# EAGLE schematic untitled (EAGLE 6.3)
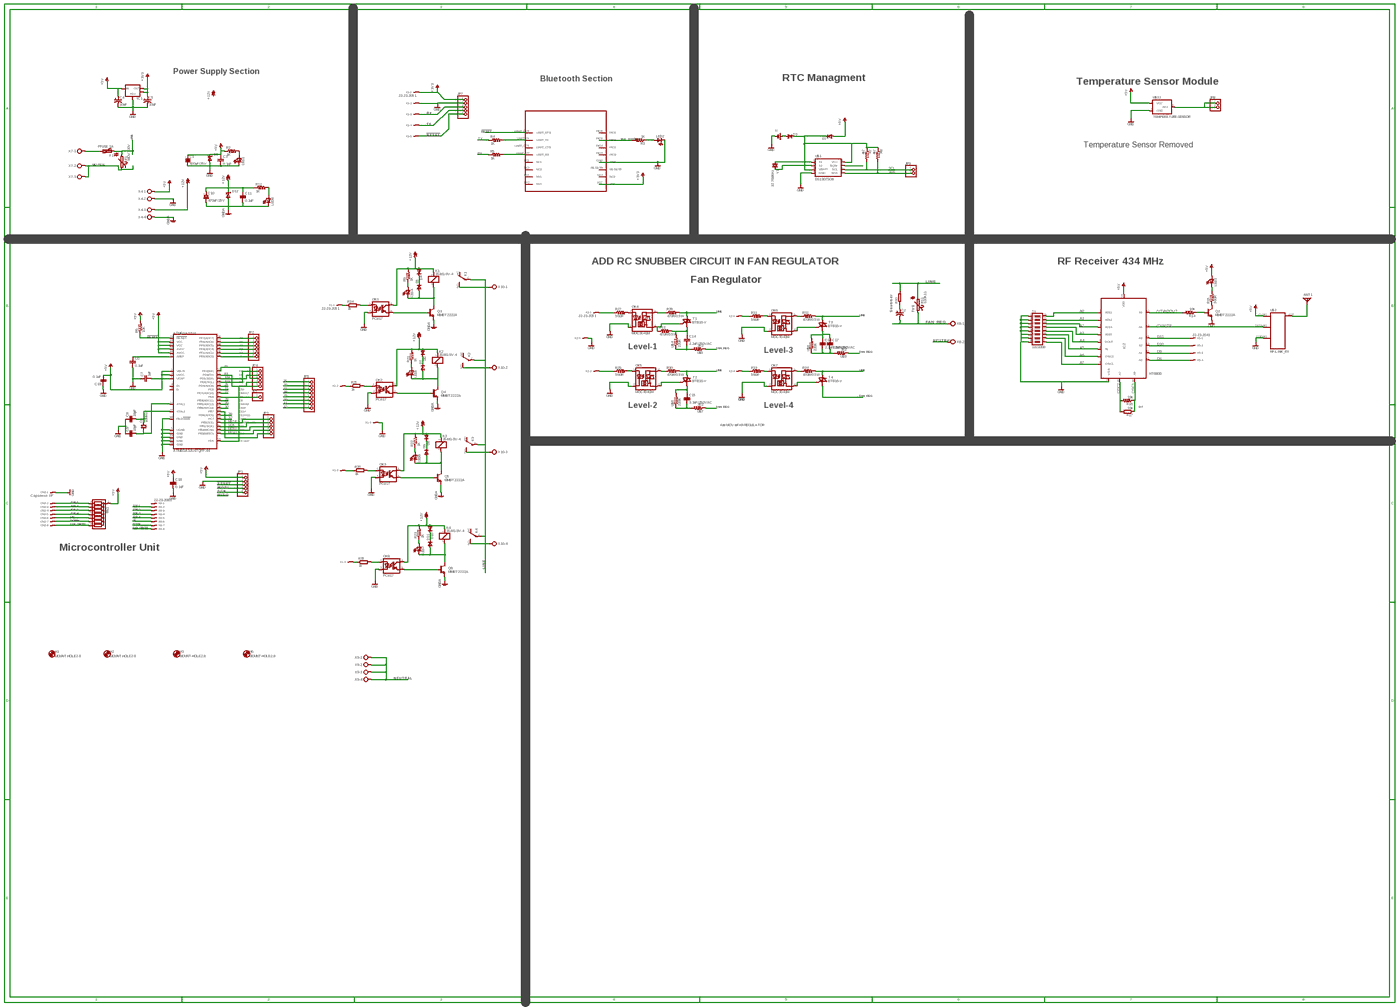
[diagram p0: schematic, sheet 1, overview]
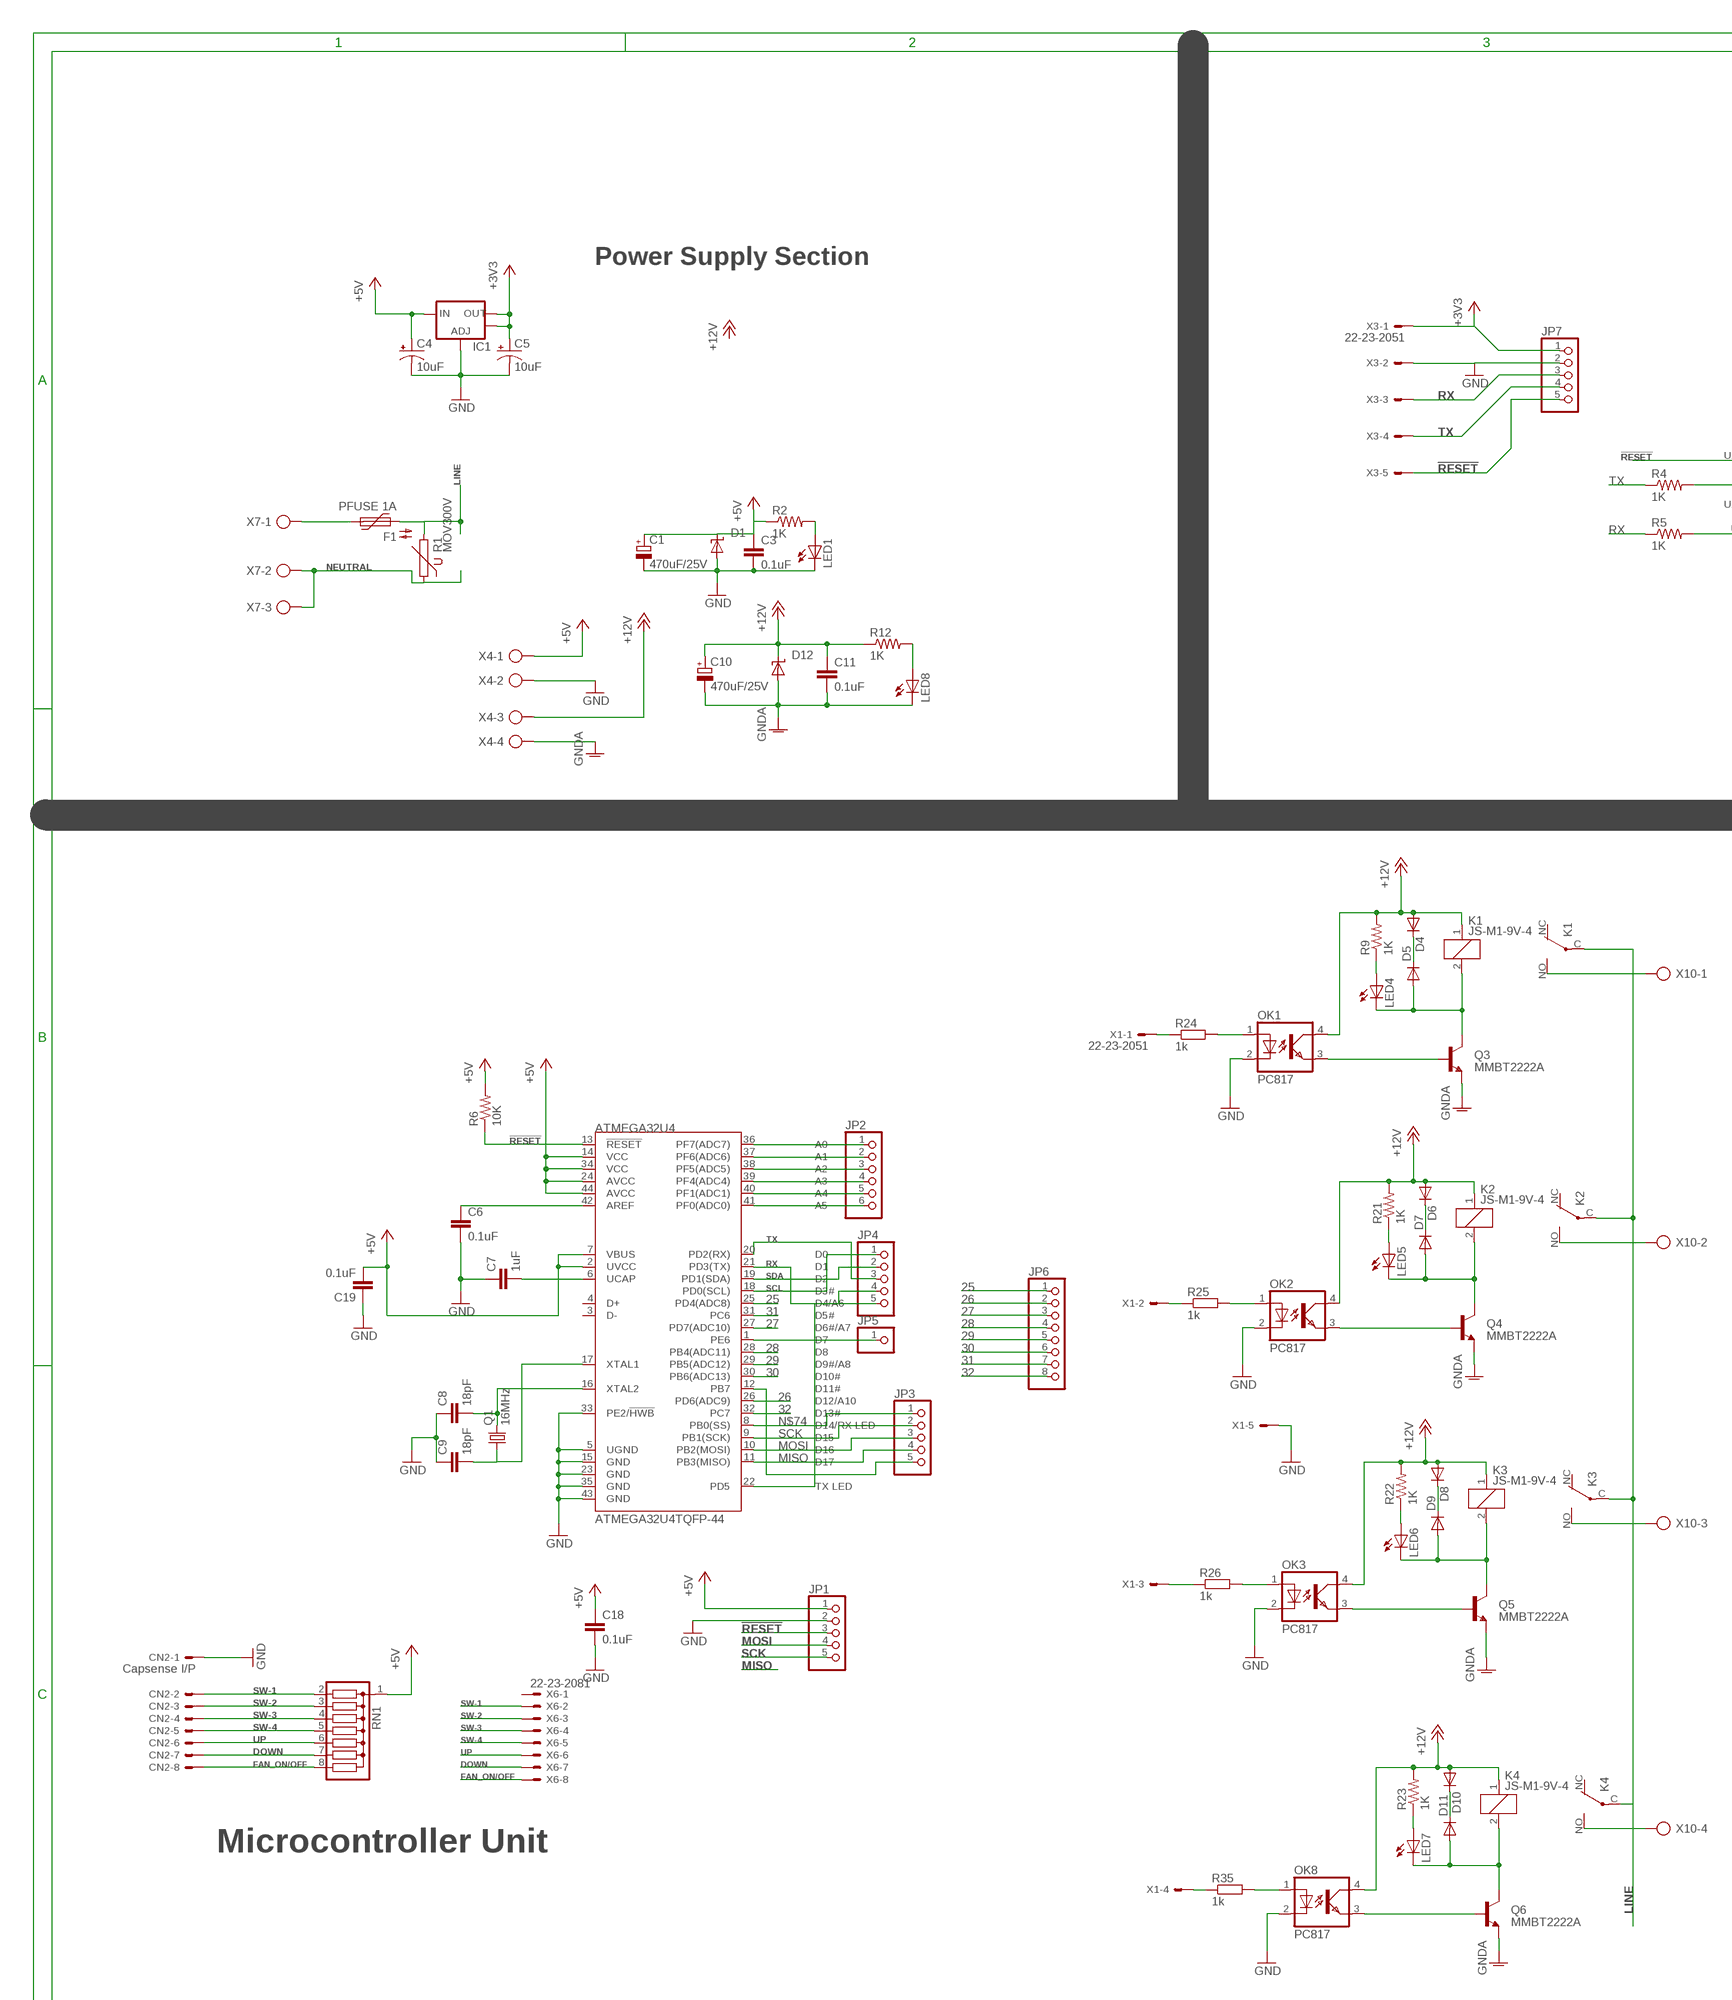
[diagram p1: schematic, sheet 1, part 1 of 6]
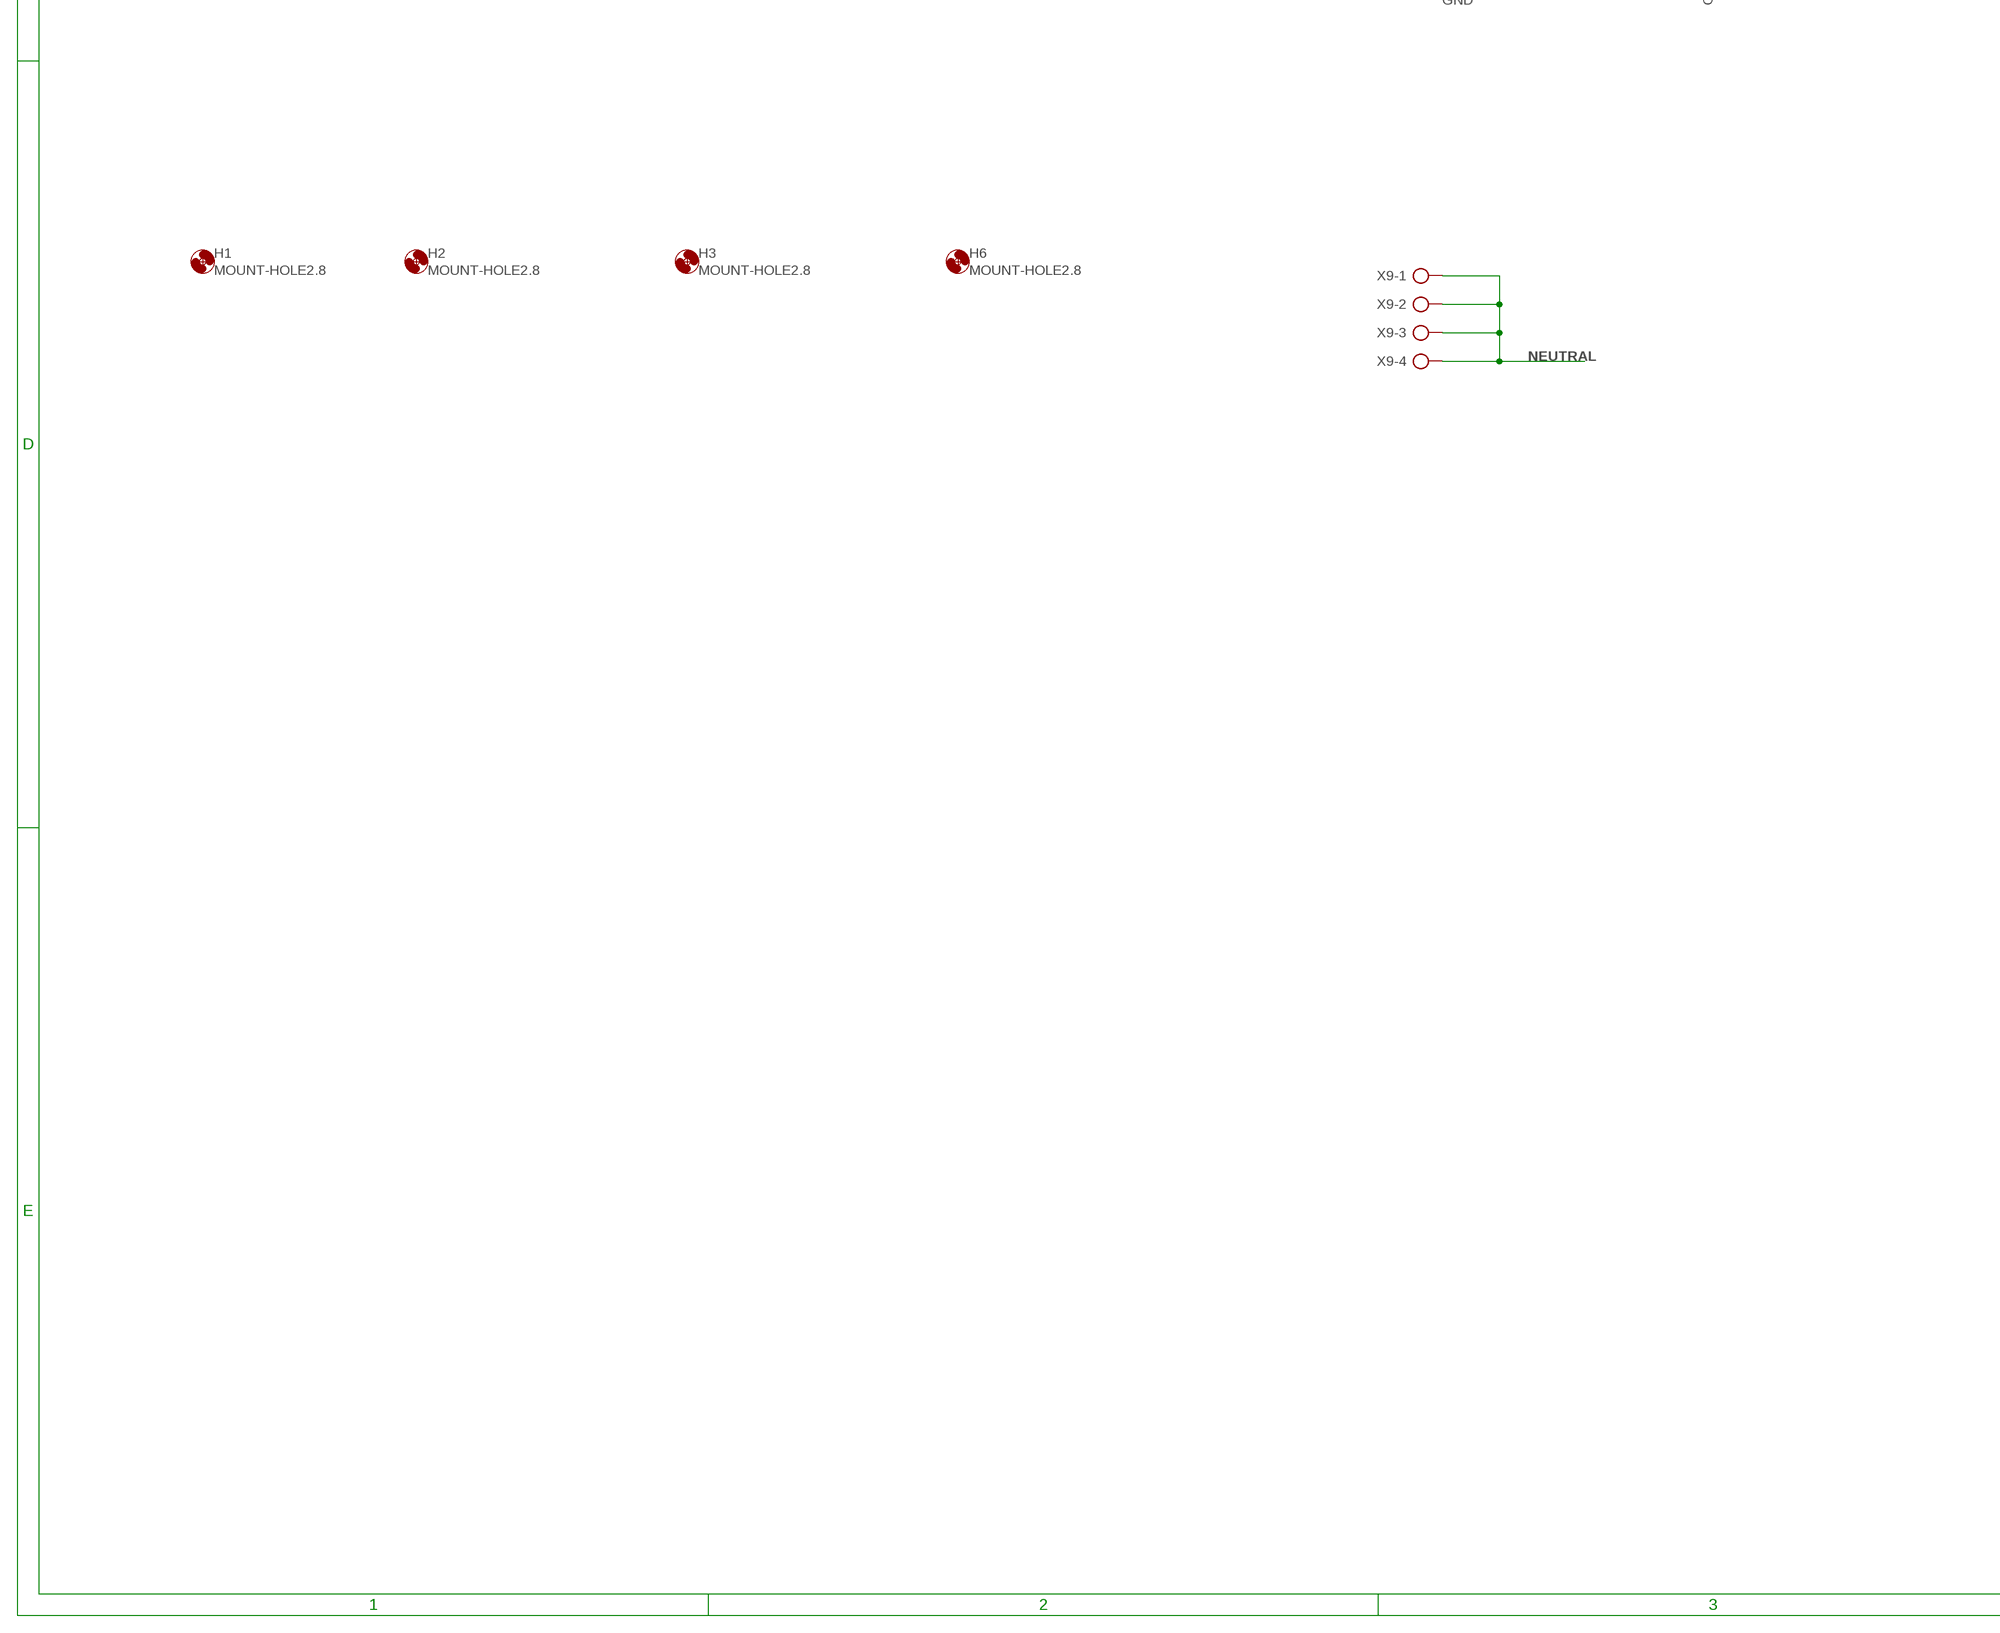
[diagram p2: schematic, sheet 1, part 2 of 6]
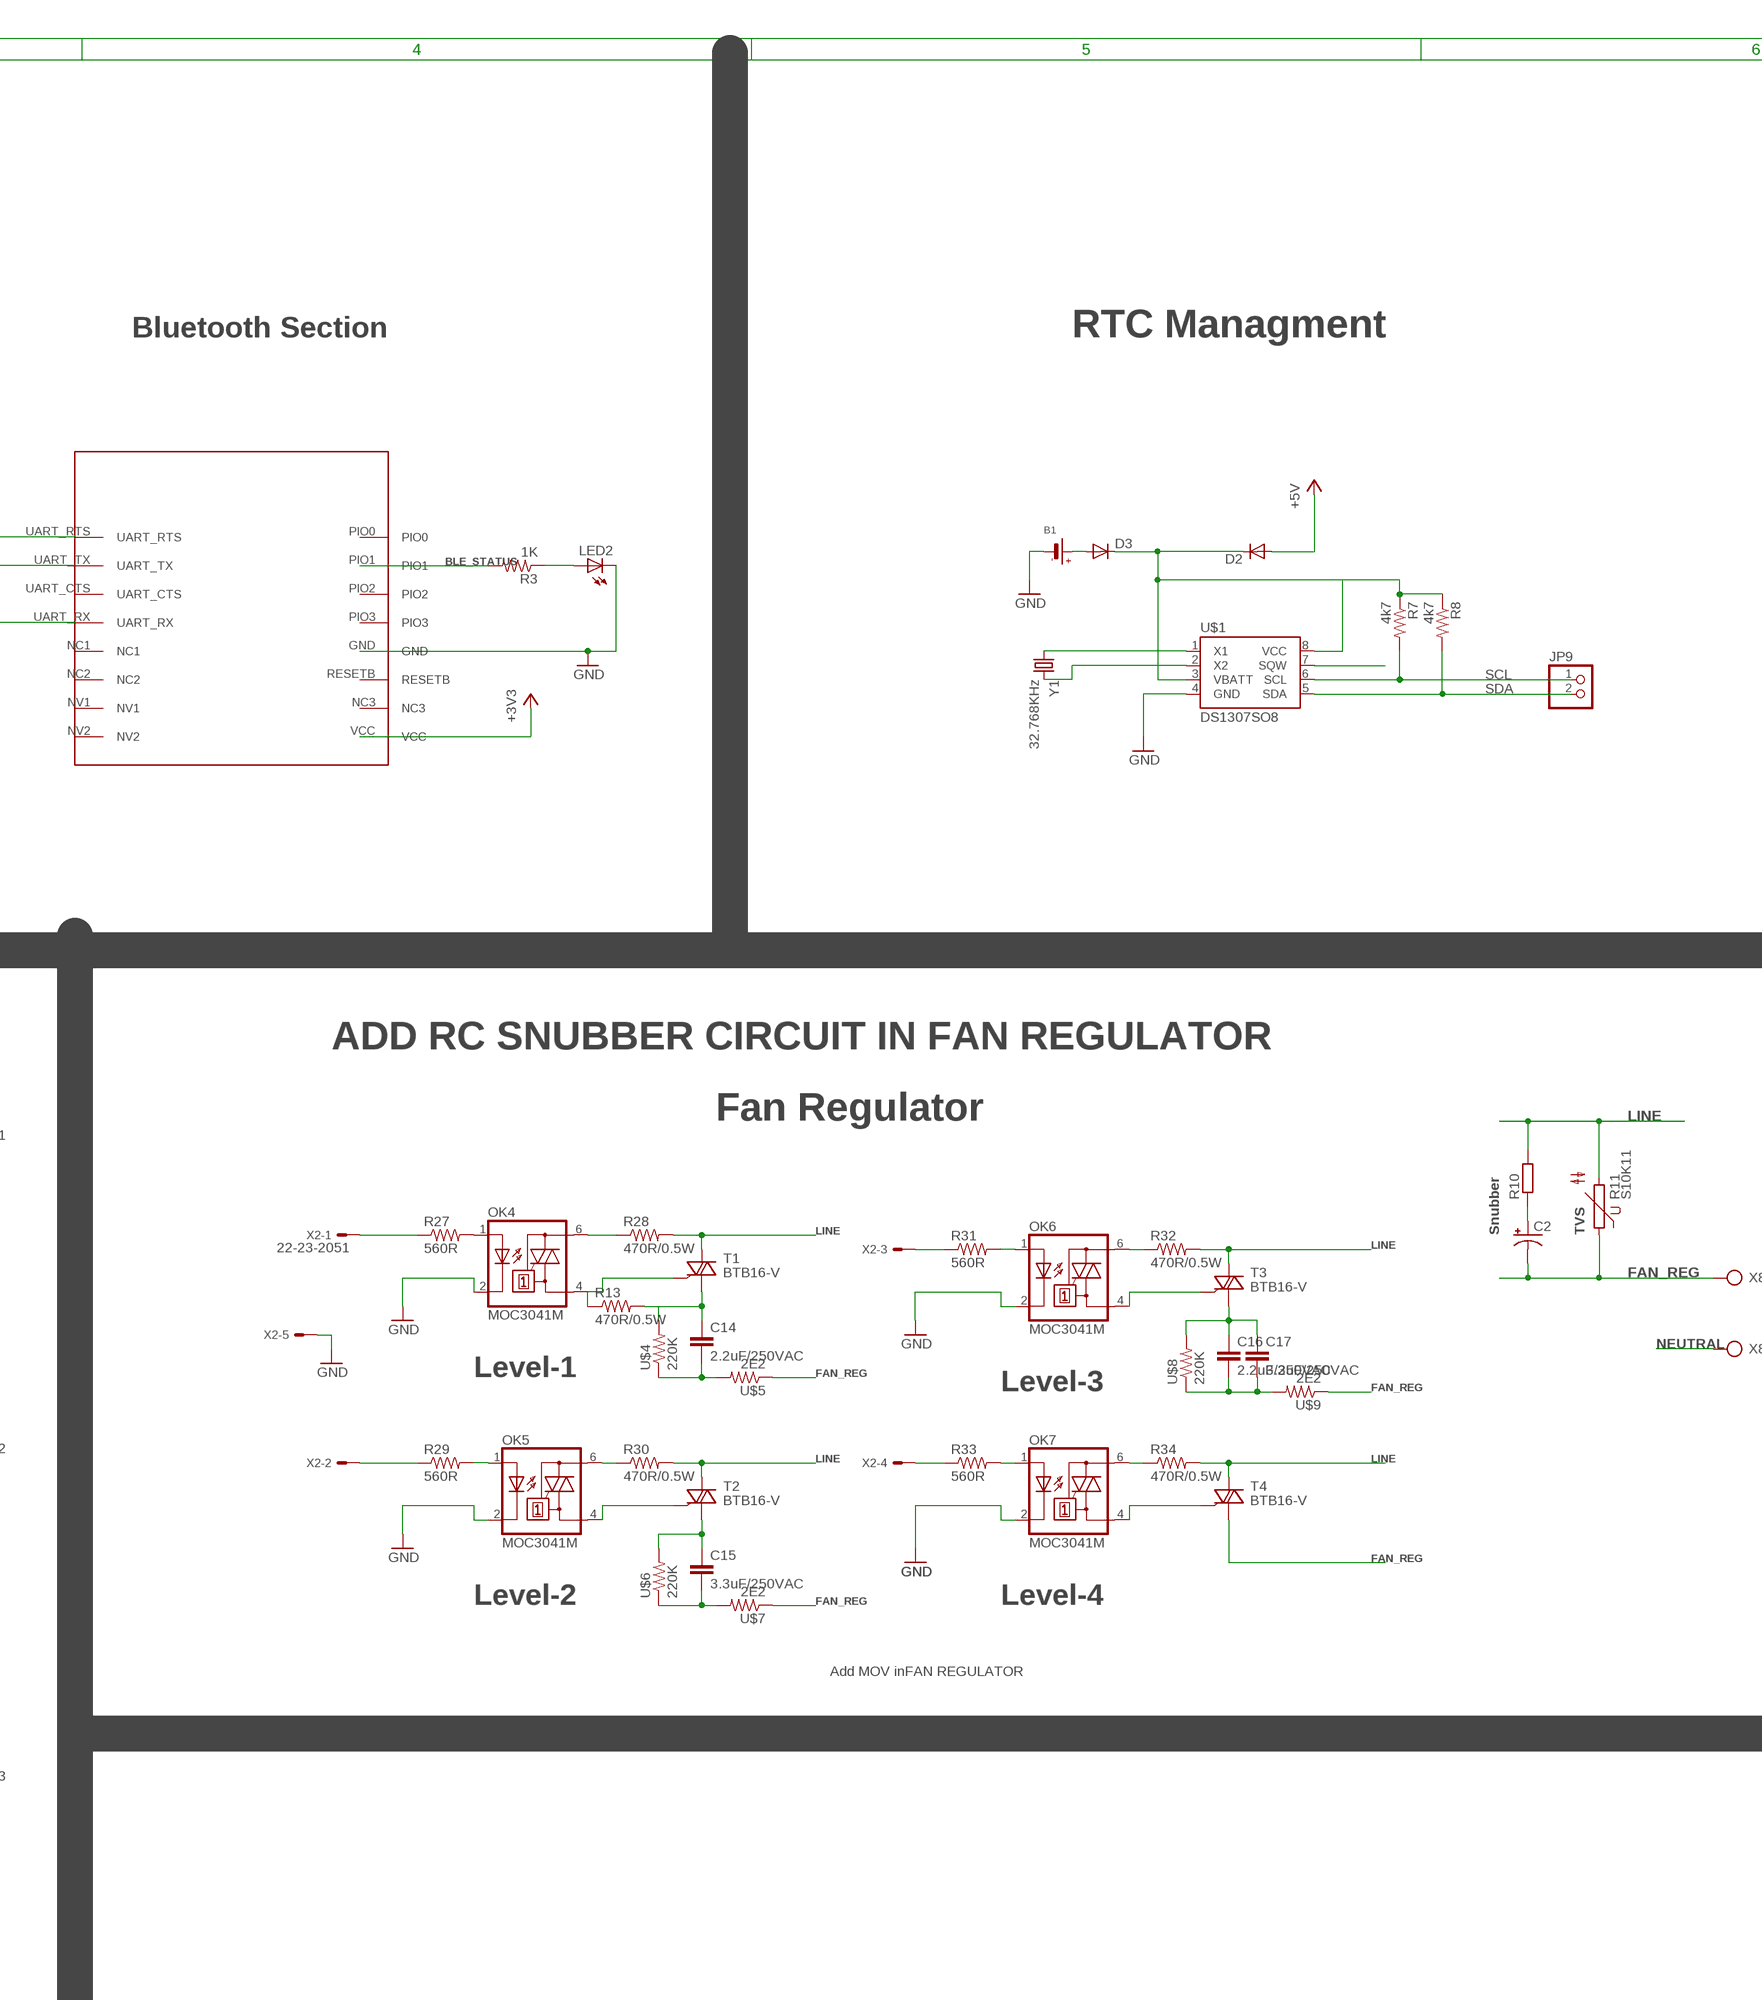
[diagram p3: schematic, sheet 1, part 3 of 6]
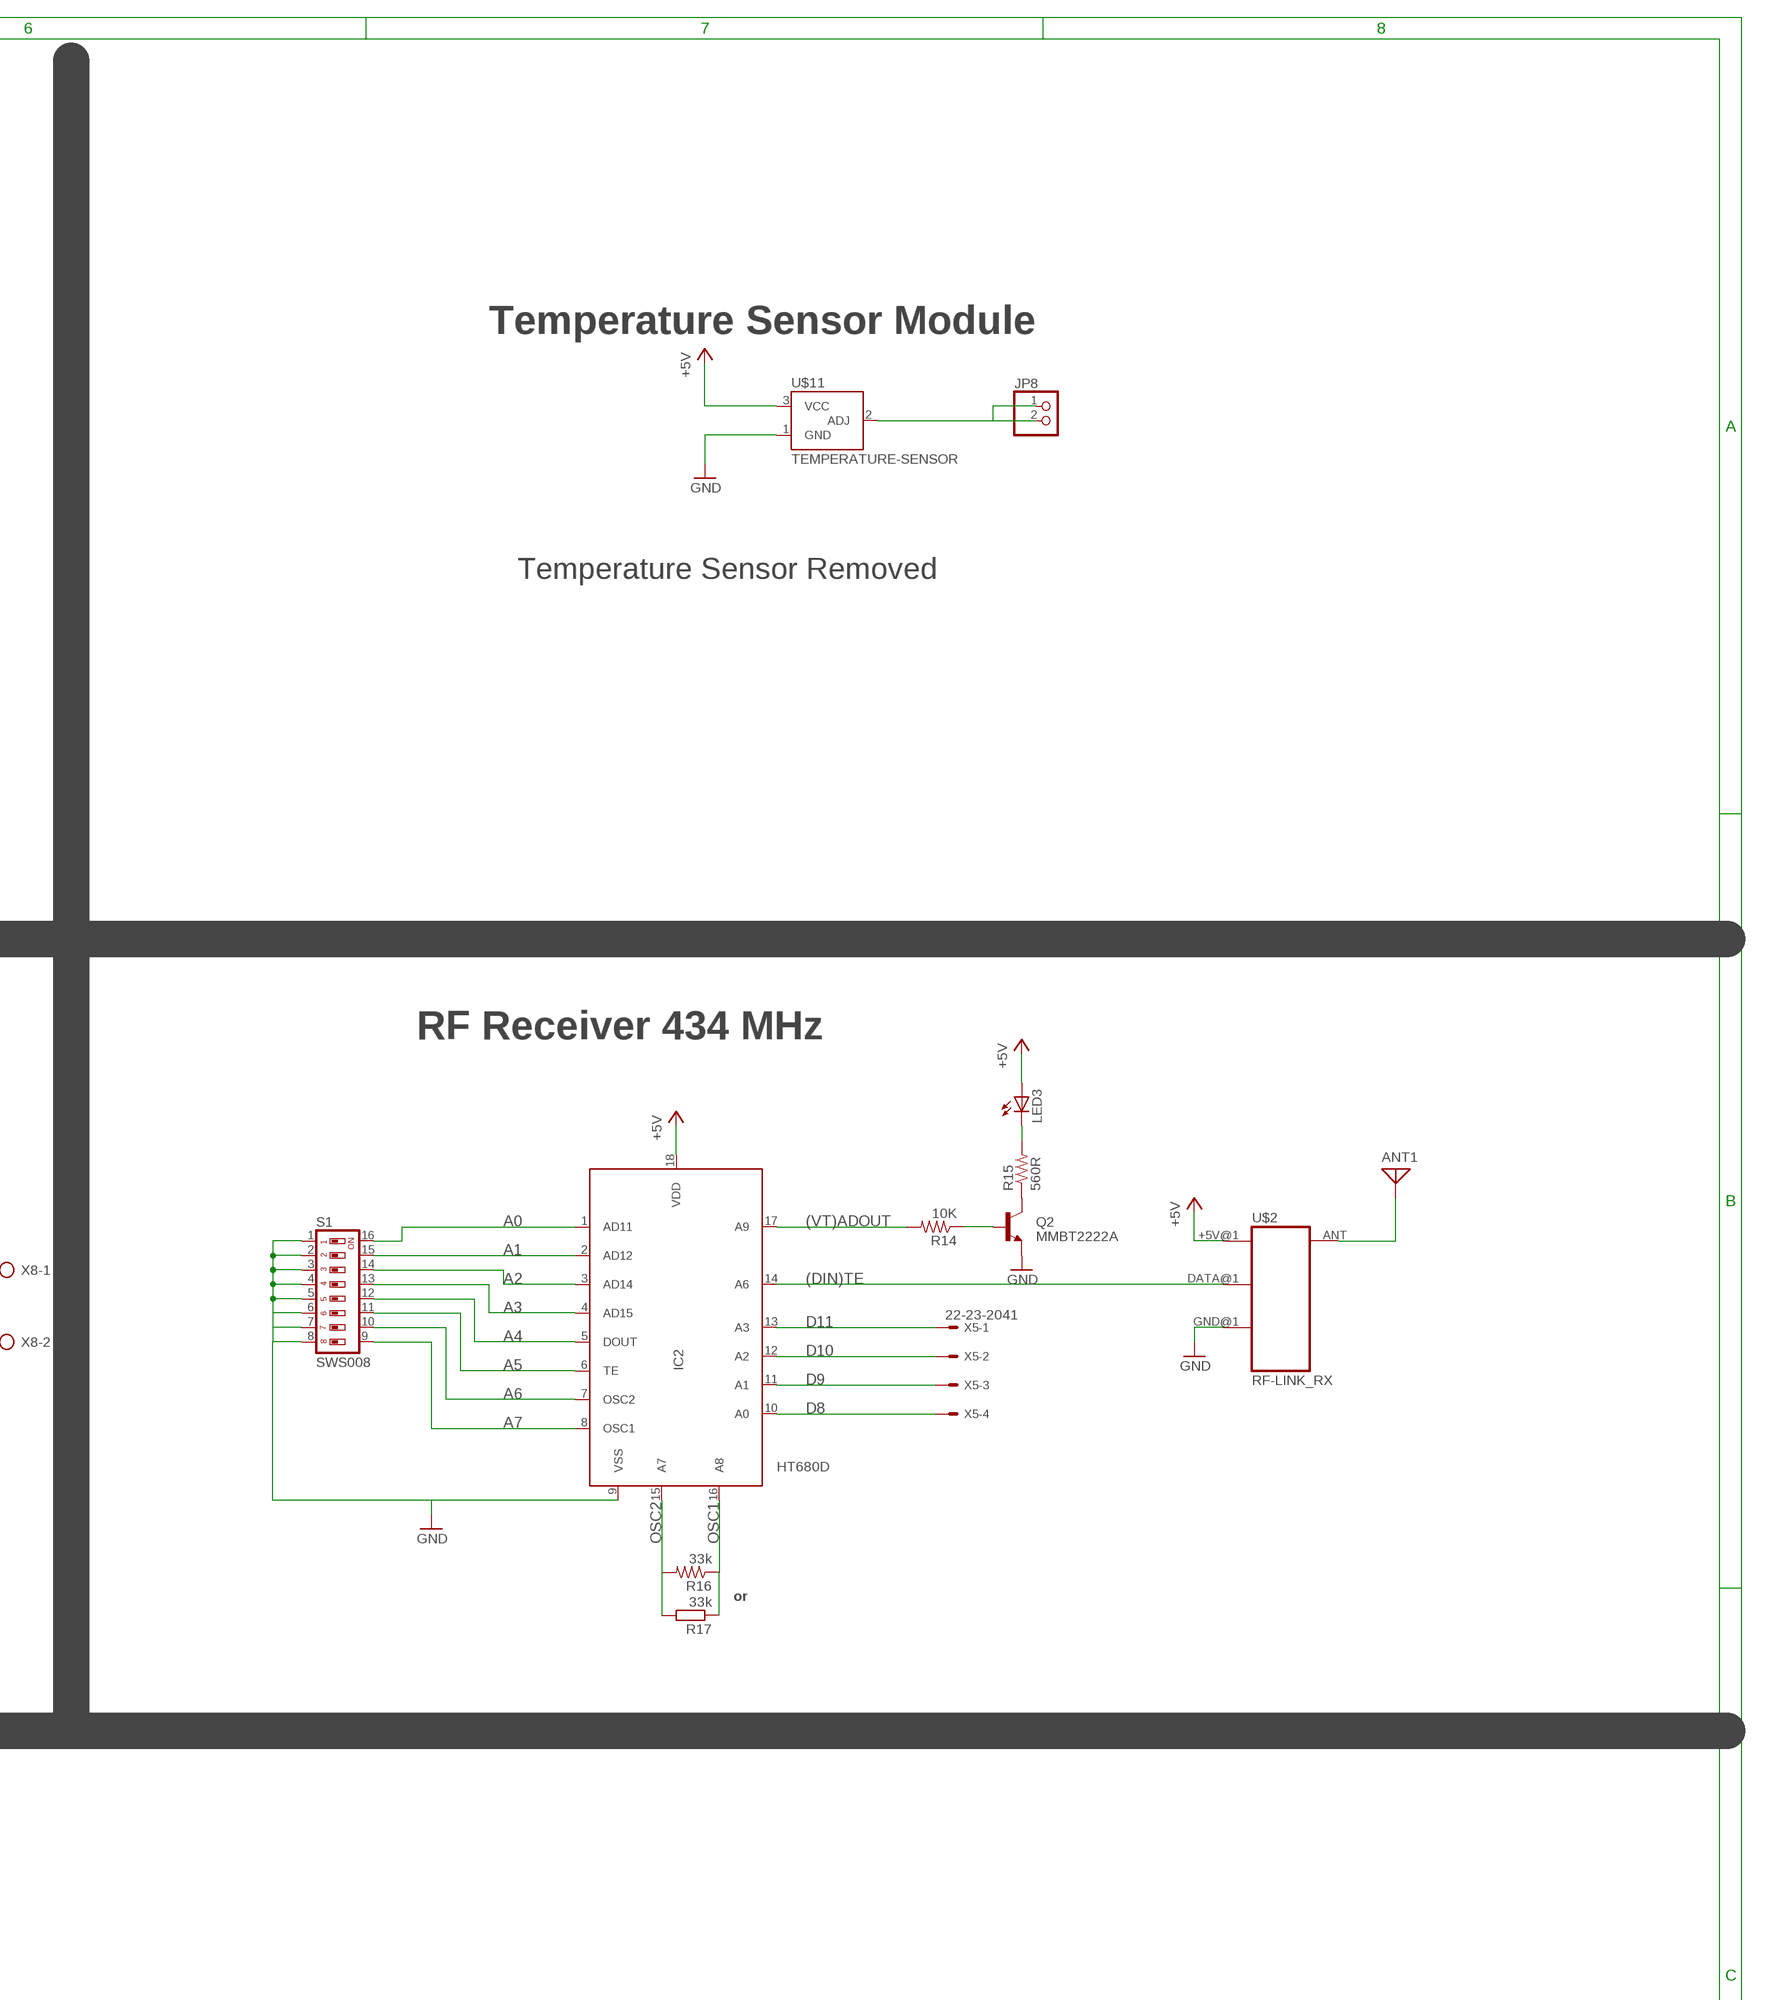
[diagram p4: schematic, sheet 1, part 4 of 6]
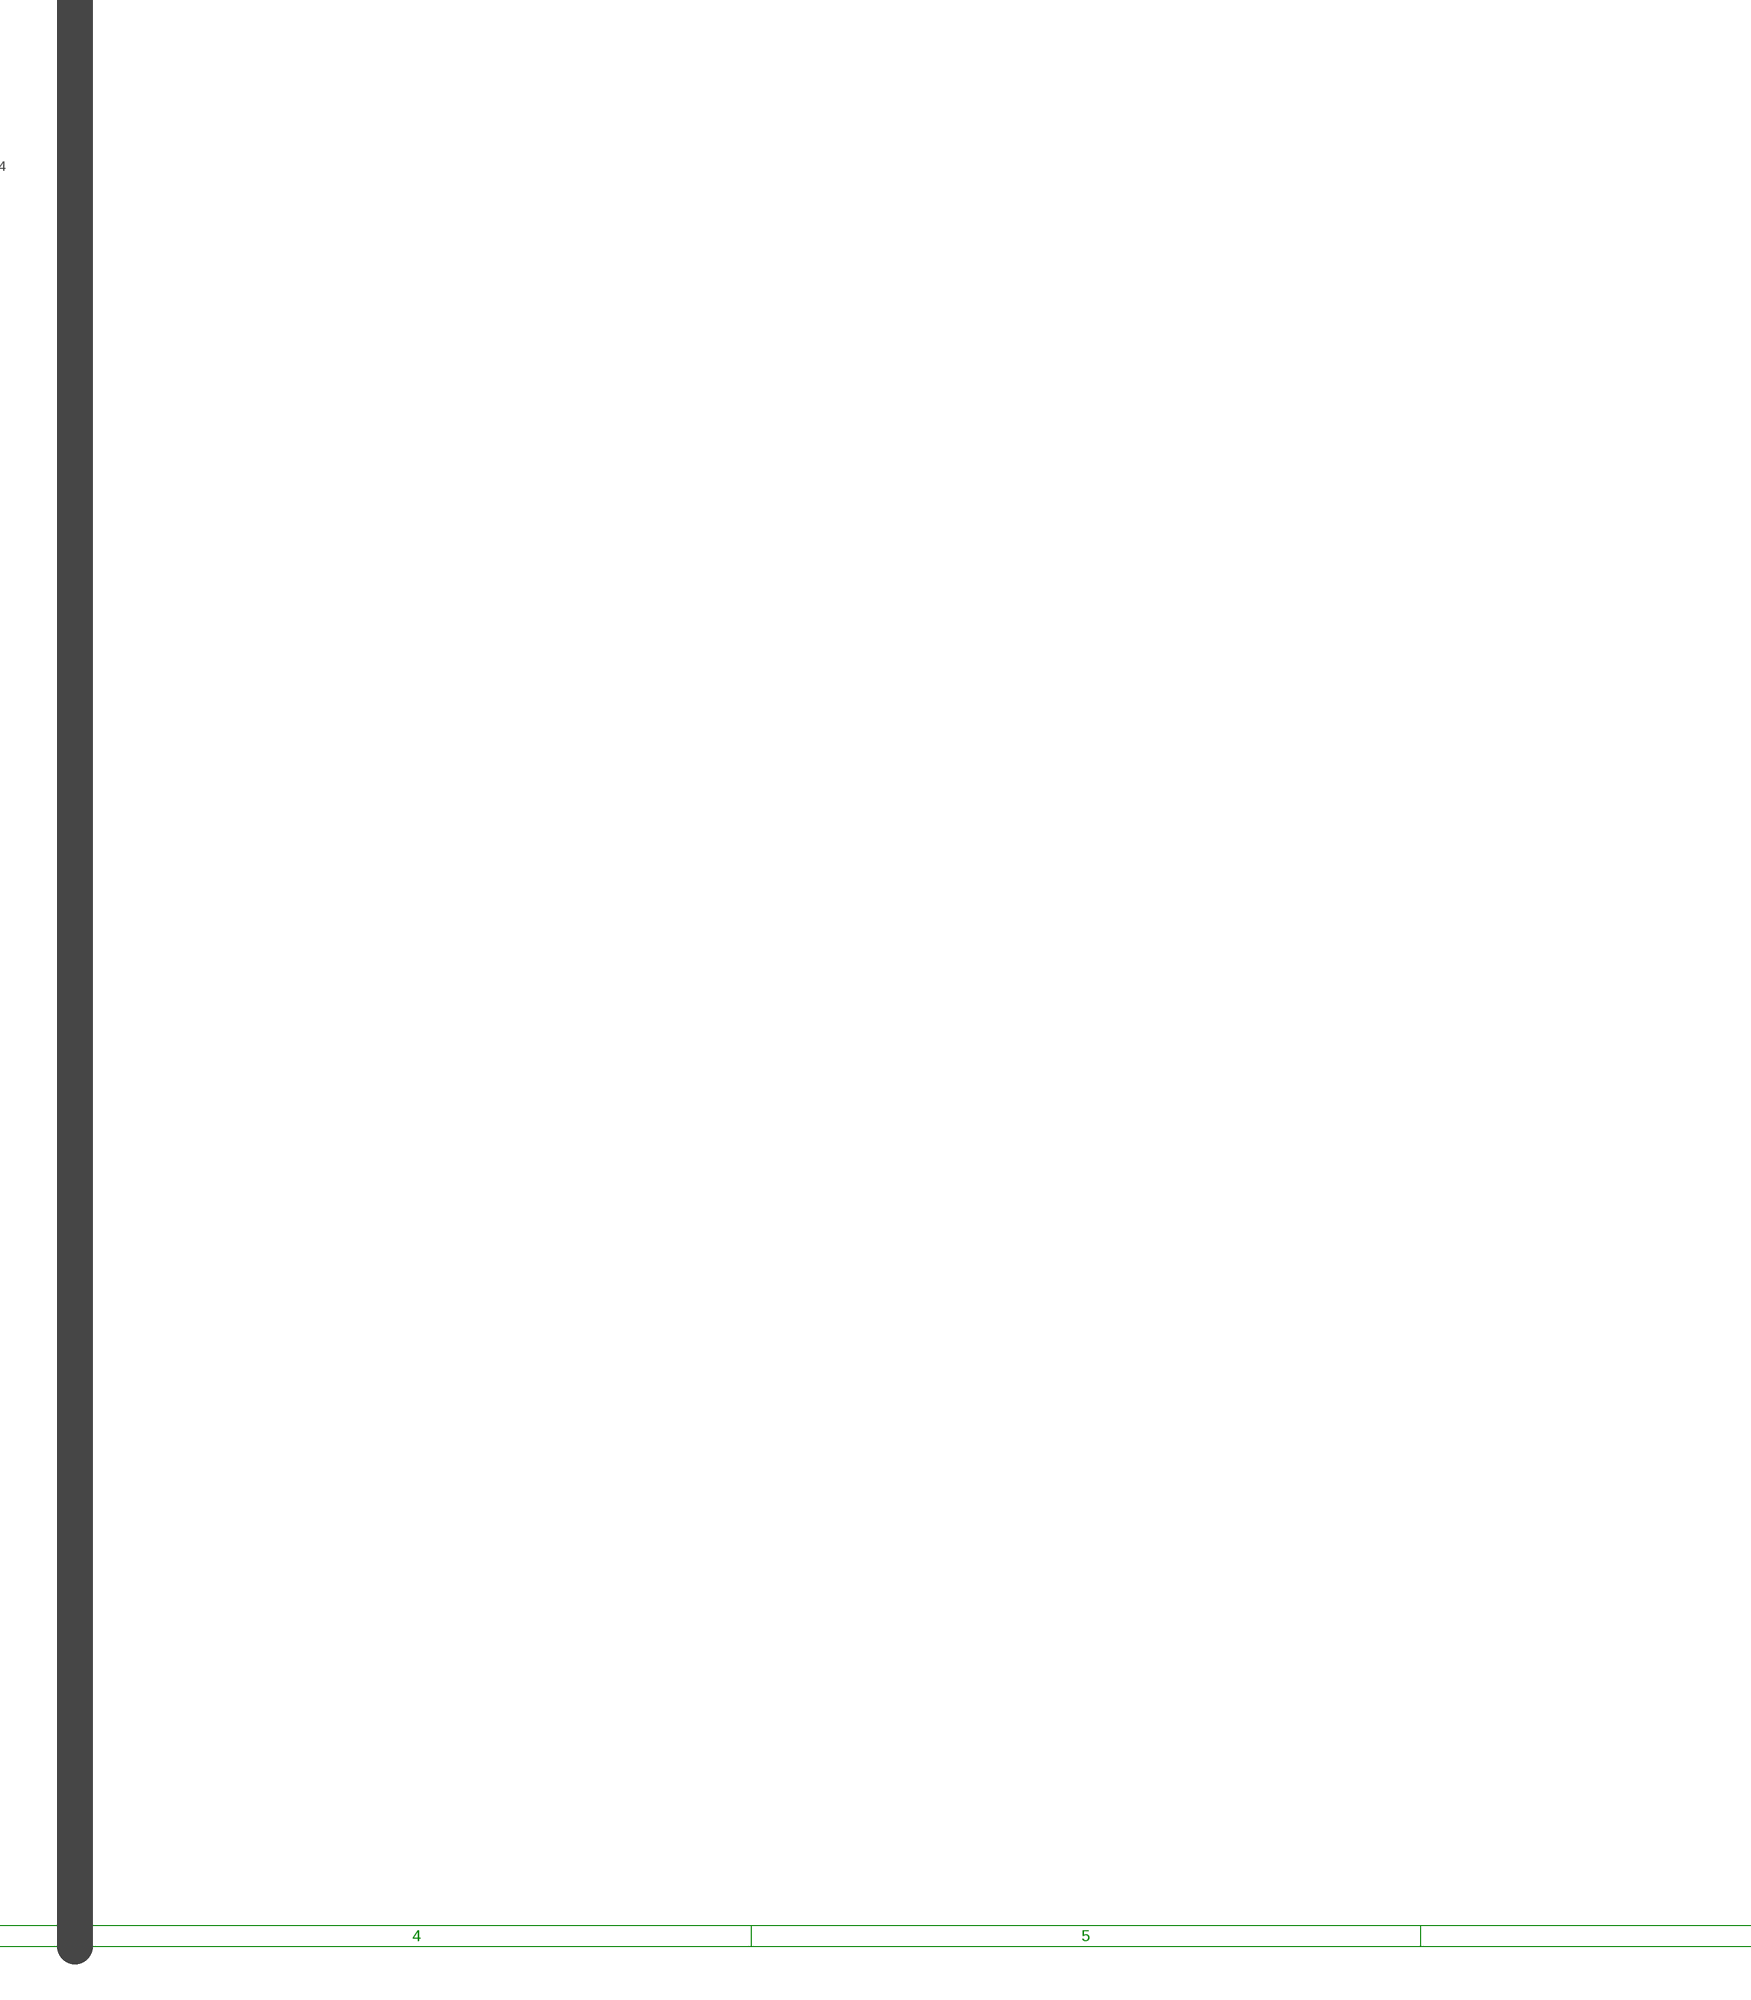
[diagram p5: schematic, sheet 1, part 5 of 6]
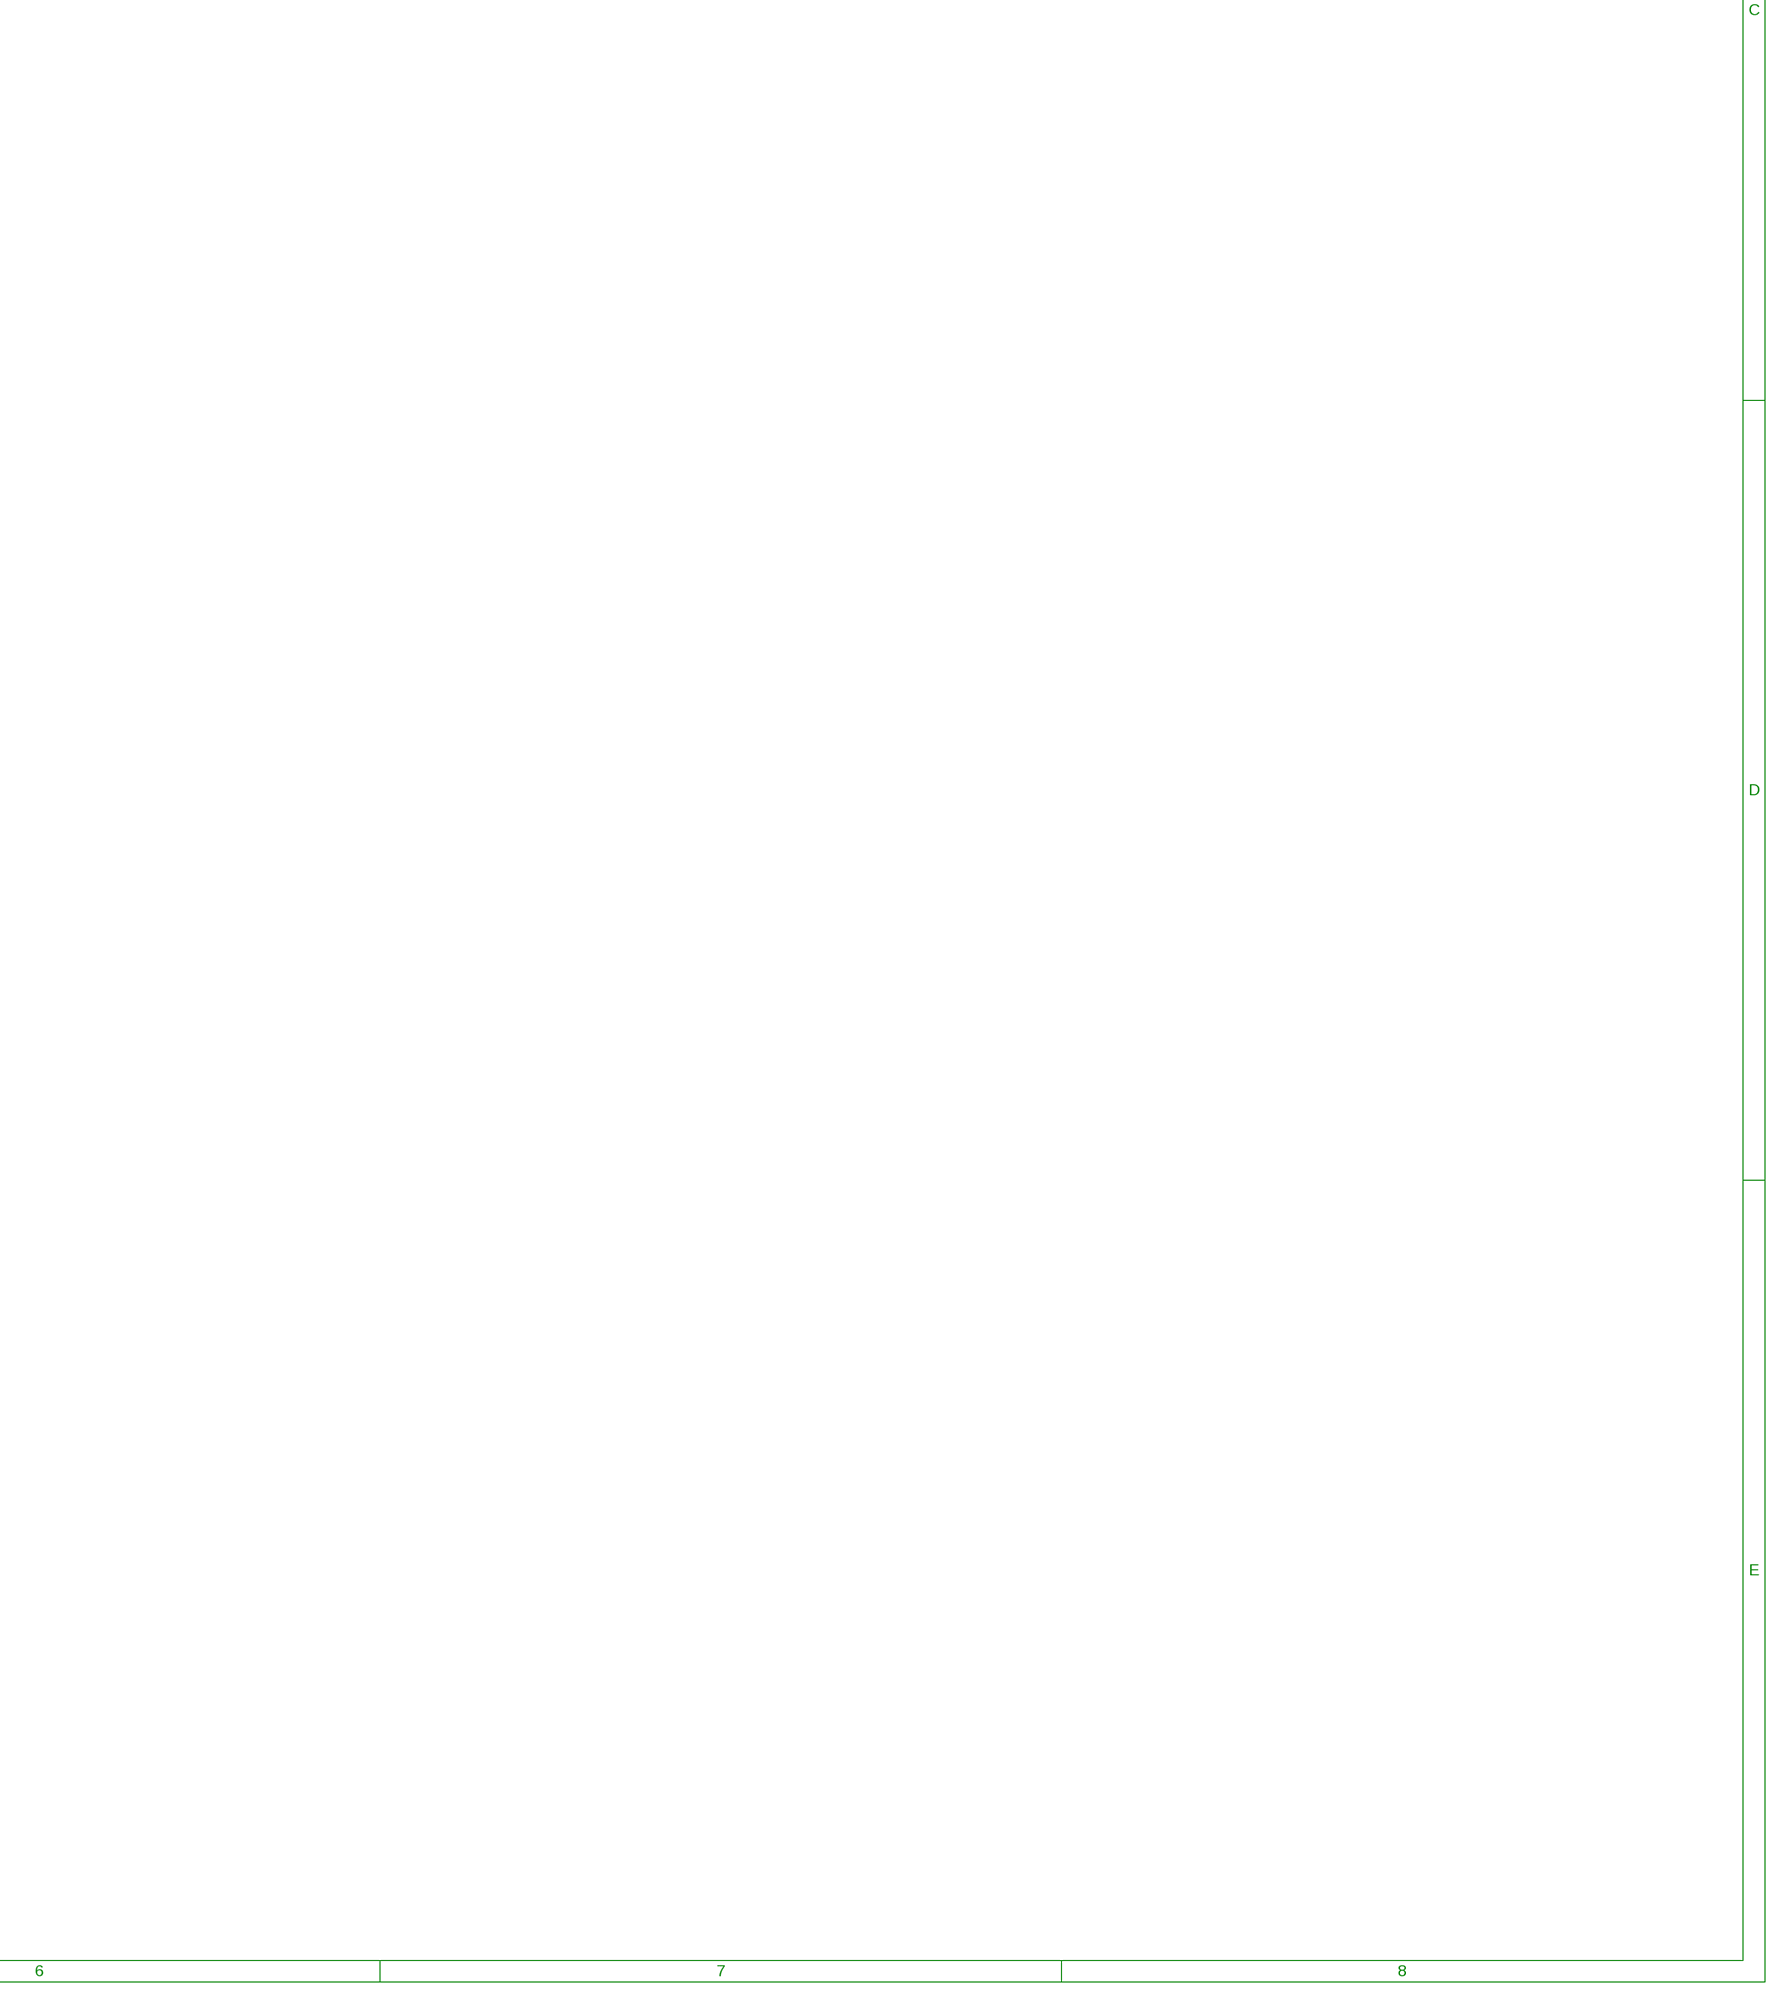
[diagram p6: schematic, sheet 1, part 6 of 6]

## Parts
ANT1  ANTENNA  [PAD-01]
ATMEGA32U4  ATMEGA32U4TQFP-44  [TQFP44]
B1  BATTERYCR2032  [CR2032]
C1  470uF/25V  CPOL-EUE5-8.5  [E5-8,5]
C2  CPOL-USE5-9VAXIAL  [E5R]
C3  0.1uF  1.0UF50V10%(1206)  [1206]
C4  10uF  10UF-16V-10%(TANT)  [EIA3216]
C5  10uF  10UF-16V-10%(TANT)  [EIA3216]
C6  0.1uF  CAP1206  [1206]
C7  1uF  CAP1206  [1206]
C8  18pF  CAP1206  [1206]
C9  18pF  CAP1206  [1206]
C10  470uF/25V  CPOL-EUE5-8.5  [E5-8,5]
C11  0.1uF  1.0UF50V10%(1206)  [1206]
C14  2.2uF/250VAC  C27/9  [C27.5B9]
C15  3.3uF/250VAC  C27/9  [C27.5B9]
C16  2.2uF/250VAC  C27/9  [C27.5B9]
C17  3.3uF/250VAC  C27/9  [C27.5B9]
C18  0.1uF  CAP1206  [1206]
C19  0.1uF  CAP1206  [1206]
CN2  Capsense I/P  22-23-2081  [22-23-2081]
D1  SUPPRESSOR-SMBJ  [SMBJ]
D2  DIODE-D-5  [D-5]
D3  DIODE-D-5  [D-5]
D4  DIODE-D-2.5  [D-2.5]
D5  DIODE-D-2.5  [D-2.5]
D6  DIODE-D-2.5  [D-2.5]
D7  DIODE-D-2.5  [D-2.5]
D8  DIODE-D-2.5  [D-2.5]
D9  DIODE-D-2.5  [D-2.5]
D10  DIODE-D-2.5  [D-2.5]
D11  DIODE-D-2.5  [D-2.5]
D12  SUPPRESSOR-SMBJ  [SMBJ]
F1  PFUSE 1A  MF-R055-5,1B  [MF-5,1B]
H1  MOUNT-HOLE2.8  [2,8]
H2  MOUNT-HOLE2.8  [2,8]
H3  MOUNT-HOLE2.8  [2,8]
H6  MOUNT-HOLE2.8  [2,8]
IC1  V_REG_LM1117SOT223  [SOT223]
IC2  HT680D  [SOP18]
JP1  PINHD-1X5  [1X05]
JP2  PINHD-1X6  [1X06]
JP3  PINHD-1X5  [1X05]
JP4  PINHD-1X5  [1X05]
JP5  PINHD-1X1  [1X01]
JP6  PINHD-1X8  [1X08]
JP7  PINHD-1X5  [1X05]
JP8  PINHD-1X2  [1X02]
JP9  PINHD-1X2  [1X02]
K1  JS-M1-9V-4  [JS-M]
K2  JS-M1-9V-4  [JS-M]
K3  JS-M1-9V-4  [JS-M]
K4  JS-M1-9V-4  [JS-M]
LED1  LED3MM  [LED3MM]
LED2  LEDSML1206  [SML1206]
LED3  LED3MM  [LED3MM]
LED4  LED3MM  [LED3MM]
LED5  LED3MM  [LED3MM]
LED6  LED3MM  [LED3MM]
LED7  LED3MM  [LED3MM]
LED8  LED3MM  [LED3MM]
OK1  PC817  [DIL04]
OK2  PC817  [DIL04]
OK3  PC817  [DIL04]
OK4  MOC3041M  [DIL06]
OK5  MOC3041M  [DIL06]
OK6  MOC3041M  [DIL06]
OK7  MOC3041M  [DIL06]
OK8  PC817  [DIL04]
Q1  16MHz  CRYSTALHC49UP  [HC49UP]
Q2  MMBT2222A  TRANSISTOR_NPNMMBT2222A  [SOT23-3]
Q3  MMBT2222A  TRANSISTOR_NPNBC547  [TO-92-AMMO]
Q4  MMBT2222A  TRANSISTOR_NPNBC547  [TO-92-AMMO]
Q5  MMBT2222A  TRANSISTOR_NPNBC547  [TO-92-AMMO]
Q6  MMBT2222A  TRANSISTOR_NPNBC547  [TO-92-AMMO]
R1  MOV300V  S10K11  [S10K11]
R2  1K  RESISTOR1206  [1206]
R3  1K  RESISTOR1206  [1206]
R4  1K  RESISTOR1206  [1206]
R5  1K  RESISTOR1206  [1206]
R6  10K  RESISTOR1206  [1206]
R7  4k7  RESISTOR1206  [1206]
R8  4k7  RESISTOR1206  [1206]
R9  1K  RESISTOR1206  [1206]
R10  R-EU_0411/3V  [0411V]
R11  S10K11  [S10K11]
R12  1K  RESISTOR1206  [1206]
R13  470R/0.5W  R-US_0411/3V  [0411V]
R14  10K  RESISTOR1206  [1206]
R15  560R  RESISTOR1206  [1206]
R16  33k  RESISTOR1206  [1206]
R17  33k  R-EU_0207/2V  [0207/2V]
R21  1K  RESISTOR1206  [1206]
R22  1K  RESISTOR1206  [1206]
R23  1K  RESISTOR1206  [1206]
R24  1k  R-EU_0207/10  [0207/10]
R25  1k  R-EU_0207/10  [0207/10]
R26  1k  R-EU_0207/10  [0207/10]
R27  560R  RESISTOR1206  [1206]
R28  470R/0.5W  R-US_0411/3V  [0411V]
R29  560R  RESISTOR1206  [1206]
R30  470R/0.5W  R-US_0411/3V  [0411V]
R31  560R  RESISTOR1206  [1206]
R32  470R/0.5W  R-US_0411/3V  [0411V]
R33  560R  RESISTOR1206  [1206]
R34  470R/0.5W  R-US_0411/3V  [0411V]
R35  1k  R-EU_0207/10  [0207/10]
RN1  G07R  [SIL8]
S1  SWS008  [SMS-008]
T1  BTB16-V  BT138-V  [TO220BV]
T2  BTB16-V  BT138-V  [TO220BV]
T3  BTB16-V  BT138-V  [TO220BV]
T4  BTB16-V  BT138-V  [TO220BV]
U$1  DS1307SO8  [SO08]
U$2  RF-LINK_RX  [RF-LINK_RX]
U$3  HM-11  [HM-11]
U$4  220K  RESISTOR1206  [1206]
U$5  2E2  RESISTOR1206  [1206]
U$6  220K  RESISTOR1206  [1206]
U$7  2E2  RESISTOR1206  [1206]
U$8  220K  RESISTOR1206  [1206]
U$9  2E2  RESISTOR1206  [1206]
U$11  TEMPERATURE-SENSOR  [TO-92]
X1  22-23-2051  [22-23-2051]
X2  22-23-2051  [22-23-2051]
X3  22-23-2051  [22-23-2051]
X4  AK300/4  [AK300/4]
X5  22-23-2041  [22-23-2041]
X6  22-23-2081  [22-23-2081]
X7  AK300/3  [AK300/3]
X8  AK300/2  [AK300/2]
X9  AK300/4  [AK300/4]
X10  AK300/4  [AK300/4]
Y1  32.768KHz  CRYSTALTC26V  [TC26V]

## Nets
25: ATMEGA32U4.25(PD4(ADC8)) JP6.1
26: ATMEGA32U4.26(PD6(ADC9)) JP6.2
27: ATMEGA32U4.27(PD7(ADC10)) JP6.3
28: ATMEGA32U4.28(PB4(ADC11)) JP6.4
29: ATMEGA32U4.29(PB5(ADC12)) JP6.5
30: ATMEGA32U4.30(PB6(ADC13)) JP6.6
31: ATMEGA32U4.31(PC6) JP6.7
32: ATMEGA32U4.32(PC7) JP6.8
!RESET: ATMEGA32U4.13(!RESET) JP1.3 JP7.5 R6.1 U$3.UART_RTS X3.5
(DIN)TE: IC2.14(A6) U$2.DATA@1(DATA)
(VT)ADOUT: IC2.17(A9) R14.2
+3V3: C5.A(+) IC1.2(OUT) IC1.4(OUT) JP7.1 U$3.VCC X3.1
+5V: ATMEGA32U4.2(UVCC) ATMEGA32U4.7(VBUS) ATMEGA32U4.14(VCC) ATMEGA32U4.24(AVCC) ATMEGA32U4.34(VCC) ATMEGA32U4.44(AVCC) C1.+ C3.1 C4.A(+) C18.1 C19.2 D1.C D2.A IC1.3(IN) IC2.18(VDD) JP1.1 LED3.A R2.1 R6.2 RN1.1 U$2.+5V@1(+5V) U$11.3(VCC) X4.1
+12V: C10.+ C11.1 D4.A D6.A D8.A D10.A D12.C K1.1 K2.1 K3.1 K4.1 OK1.4(COL) OK2.4(COL) OK3.4(COL) OK8.4(COL) R9.2 R12.1 R21.2 R22.2 R23.2 X4.3
A0: IC2.1(AD11) S1.16
A1: IC2.2(AD12) S1.15
A2: IC2.3(AD14) S1.14
A3: IC2.4(AD15) S1.13
A4: IC2.5(DOUT) S1.12
A5: IC2.6(TE) S1.11
A6: IC2.7(OSC2) S1.10
A7: IC2.8(OSC1) S1.9
BLE_STATUS: R3.2 U$3.PIO1
D8: IC2.10(A0) X5.4
D9: IC2.11(A1) X5.3
D10: IC2.12(A2) X5.2
D11: IC2.13(A3) X5.1
DOWN: CN2.7 RN1.7 X6.7
FAN_ON/OFF: CN2.8 RN1.8 X6.8
FAN_REG: C2.- R11.1 T4.T1(A1) U$5.1 U$7.1 U$9.1 X8.1
GND: ATMEGA32U4.5(UGND) ATMEGA32U4.15(GND) ATMEGA32U4.23(GND) ATMEGA32U4.33(PE2/!HWB) ATMEGA32U4.35(GND) ATMEGA32U4.43(GND) B1.- C1.- C3.2 C4.C(-) C5.C(-) C6.2 C7.1 C8.1 C9.1 C18.2 C19.1 CN2.1 D1.A IC1.1(ADJ) IC2.9(VSS) JP1.2 JP7.2 LED1.K(C) LED2.C OK1.2(C) OK2.2(C) OK3.2(C) OK4.2(C) OK5.2(C) OK6.2(C) OK7.2(C) OK8.2(C) Q2.2(E) S1.1 S1.2 S1.3 S1.4 S1.5 S1.6 S1.7 S1.8 U$1.4(GND) U$2.GND@1(GND) U$3.GND U$11.1(GND) X1.5 X2.5 X3.2 X4.2
GNDA: C10.- C11.2 D12.A LED8.K(C) Q3.3(E) Q4.3(E) Q5.3(E) Q6.3(E) X4.4
LINE: F1.1 K1.C(2:P) K2.C(2:P) K3.C(2:P) K4.C(2:P) R1.2 R10.2 R11.2 R28.2 R30.2 R32.2 R34.2 T1.T2(A2) T2.T2(A2) T3.T2(A2) T4.T2(A2)
MISO: ATMEGA32U4.11(PB3(MISO)) JP3.4
MOSI: ATMEGA32U4.10(PB2(MOSI)) JP1.4 JP3.3
N$1: OK6.1(A) R31.2
N$2: OK4.1(A) R27.2
N$3: OK5.1(A) R29.2
N$4: OK4.6(A2) R28.1
N$5: OK7.1(A) R33.2
N$6: R4.2 U$3.UART_TX
N$7: ATMEGA32U4.6(UCAP) C7.2
N$8: Q2.1(B) R14.1
N$9: LED2.A R3.1
N$10: ATMEGA32U4.42(AREF) C6.1
N$11: R5.2 U$3.UART_RX
N$12: U$1.1(X1) Y1.1
N$13: U$1.2(X2) Y1.2
N$14: D2.C D3.C R7.1 R8.1 U$1.3(VBATT) U$1.8(VCC)
N$15: LED1.A R2.2
N$16: B1.+ D3.A
N$17: C2.+ R10.1
N$18: ATMEGA32U4.36(PF7(ADC7)) JP2.1
N$19: U$1.7(SQW)
N$20: ATMEGA32U4.37(PF6(ADC6)) JP2.2
N$21: ATMEGA32U4.38(PF5(ADC5)) JP2.3
N$22: ATMEGA32U4.16(XTAL2) C8.2 Q1.2
N$23: ATMEGA32U4.17(XTAL1) C9.2 Q1.1
N$24: Q2.3(C) R15.1
N$25: R24.1 X1.1
N$26: LED4.A R9.1
N$27: LED3.K(C) R15.2
N$28: LED5.A R21.1
N$29: OK5.6(A2) R30.1
N$30: OK6.6(A2) R32.1
N$31: ANT1.1 U$2.ANT
N$32: OK1.3(EMIT) Q3.2(B)
N$33: D5.A K1.2 LED4.K(C) Q3.1(C)
N$34: OK7.6(A2) R34.1
N$35: LED6.A R22.1
N$36: F1.2 X7.1
N$37: D4.C D5.C
N$38: K4.NO(2:S) X10.4
N$39: LED7.A R23.1
N$40: OK3.1(A) R26.2
N$41: OK1.1(A) R24.2
N$42: R25.1 X1.2
N$43: OK2.3(EMIT) Q4.2(B)
N$44: R26.1 X1.3
N$45: D7.A K2.2 LED5.K(C) Q4.1(C)
N$46: D6.C D7.C
N$47: K3.NO(2:S) X10.3
N$48: R35.1 X1.4
N$49: R27.1 X2.1
N$50: OK2.1(A) R25.2
N$51: OK3.3(EMIT) Q5.2(B)
N$52: R29.1 X2.2
N$53: D9.A K3.2 LED6.K(C) Q5.1(C)
N$54: OK4.4(A1) R13.1 T1.G
N$55: C14.1 R13.2 T1.T1(A1) U$4.2
N$56: C14.2 U$4.1 U$5.2
N$57: D8.C D9.C
N$58: K2.NO(2:S) X10.2
N$59: R31.1 X2.3
N$60: R33.1 X2.4
N$61: K1.NO(2:S) X10.1
N$62: OK5.4(A1) T2.G
N$63: C15.1 T2.T1(A1) U$6.2
N$64: C15.2 U$6.1 U$7.2
N$65: LED8.A R12.2
N$66: OK8.3(EMIT) Q6.2(B)
N$67: D11.A K4.2 LED7.K(C) Q6.1(C)
N$69: D10.C D11.C
N$70: OK6.4(A1) T3.G
N$71: C16.1 C17.1 T3.T1(A1) U$8.2
N$72: C16.2 C17.2 U$8.1 U$9.2
N$74: ATMEGA32U4.8(PB0(SS)) JP3.1
N$76: ATMEGA32U4.39(PF4(ADC4)) JP2.4
N$77: OK8.1(A) R35.2
N$78: OK7.4(A1) T4.G
N$79: ATMEGA32U4.40(PF1(ADC1)) JP2.5
N$80: ATMEGA32U4.41(PF0(ADC0)) JP2.6
N$81: ATMEGA32U4.12(PB7) JP3.5
N$84: ATMEGA32U4.22(PD5) JP4.5
N$85: ATMEGA32U4.1(PE6) JP5.1
N$88: JP8.1 JP8.2 U$11.2(ADJ)
NEUTRAL: R1.1 X7.2 X7.3 X8.2 X9.1 X9.2 X9.3 X9.4
OSC1: IC2.16(A8) R16.1 R17.1
OSC2: IC2.15(A7) R16.2 R17.2
RX: ATMEGA32U4.21(PD3(TX)) JP4.4 JP7.3 R5.1 X3.3
SCK: ATMEGA32U4.9(PB1(SCK)) JP1.5 JP3.2
SCL: ATMEGA32U4.18(PD0(SCL)) JP4.1 JP9.1 R7.2 U$1.6(SCL)
SDA: ATMEGA32U4.19(PD1(SDA)) JP4.2 JP9.2 R8.2 U$1.5(SDA)
SW-1: CN2.2 RN1.2 X6.2
SW-2: CN2.3 RN1.3 X6.3
SW-3: CN2.4 RN1.4 X6.4
SW-4: CN2.5 RN1.5 X6.5
TX: ATMEGA32U4.20(PD2(RX)) JP4.3 JP7.4 R4.1 X3.4
UP: CN2.6 RN1.6 X6.6
Unconnected: ATMEGA32U4.3(D-) ATMEGA32U4.4(D+) K1.NC(2:O) K2.NC(2:O) K3.NC(2:O) K4.NC(2:O) U$3.NC1 U$3.NC2 U$3.NC3 U$3.NV1 U$3.NV2 U$3.PIO0 U$3.PIO2 U$3.PIO3 U$3.RESETB U$3.UART_CTS X6.1

## Notes on the sheet
- Power Supply Section
- Bluetooth Section | RTC Managment
- Temperature Sensor Module
- Temperature Sensor Removed
- ADD RC SNUBBER CIRCUIT IN FAN REGULATOR | RF Receiver 434 MHz
- Fan Regulator
- Snubber | TVS
- Level-1
- Level-3
- Level-2 | Level-4 | or
- Add MOV inFAN REGULATOR
- Microcontroller Unit

## Library data of the parts
ANT1 = discrete:ANTENNA: Antenna
ATMEGA32U4 = SparkFun-DigitalIC:ATMEGA32U4: Atmel 44-pin 8-bit Microcontroller with 32KBytes of ISP Flash and USB Controller
B1 = microbuilder:BATTERY: CR1220 SMT - Digikey: 3001K-ND
C1 C10 = rcl:CPOL-EU: POLARIZED CAPACITOR, European symbol
C2 = rcl:CPOL-US: POLARIZED CAPACITOR, American symbol
C3 C11 = SparkFun-Capacitors:1.0UF50V10%(1206): CAP-09822; PROD_ID: CAP-09822; VALUE: 1.0uF
C4 C5 = SparkFun-Capacitors:10UF-16V-10%(TANT): CAP-00811 1206/EIA-3216 Tantalum capacitor; PROD_ID: CAP-00811
C6-C9 C18 C19 = SparkFun-Passives:CAP: Capacitor Standard 0603 ceramic capacitor, and 0.1" leaded capacitor.
C14-C17 = capacitor-wima:C: CAPACITOR naming: grid - package width
CN2 X6 = con-molex:22-23-2081: .100" (2.54mm) Center Header - 8 Pin; MF: MOLEX; MPN: 22-23-2081; OC_FARNELL: 1756826; OC_NEWARK: 01C7592
D1 D12 = diode:SUPPRESSOR-: Suppressor diode
D2-D11 = diode:DIODE-: DIODE
F1 = bourns:MF-R055: MultiFuse Polyfuse Overcurrent Protectors
H1-H3 H6 = holes:MOUNT-HOLE: MOUNTING HOLE with drill center marker
IC1 = SparkFun-PowerIC:V_REG_LM1117: Voltage Regulator LM1117 Standard adjustable voltage regulator but in SMD form. Spark Fun Electronics SKU : COM-00595; PROD_ID: VREG-08170
IC2 = holtek:HT680: 318 Series of Encoders TE trigger type Source: http://www.holtek.com.tw/pdf/consumer/3_18ev110.pdf; OC_FARNELL: unknown; OC_NEWARK: unknown
JP1 JP3 JP4 JP7 = pinhead:PINHD-1X5: PIN HEADER
JP2 = pinhead:PINHD-1X6: PIN HEADER
JP5 = pinhead:PINHD-1X1: PIN HEADER
JP6 = pinhead:PINHD-1X8: PIN HEADER
JP8 JP9 = pinhead:PINHD-1X2: PIN HEADER
K1-K4 = relay:JS-M1*: Automotive Ultra-Miniature Power Relay NAiS Source: http://www.mew-europe.com/.. en_ds_61211_0000.pdf; OC_FARNELL: unknown; OC_NEWARK: unknown
LED1-LED8 = led:LED: LED OSRAM: - CHIPLED LG R971, LG N971, LY N971, LG Q971, LY Q971, LO R971, LY R971 LH N974, LH R974 LS Q976, LO Q976, LY Q976 LO Q996 - Hyper CHIPLED LW Q18S LB Q993, LB Q99A, LB R99A - SideLED LS A670, LO A670, LY A670, LG A670, LP A670 LB A673, LV A673, LT A673, LW A673 LH A674 LY A675 LS A676, LA A676, LO A676, LY A676, LW A676 LS A679, LY A679, LG A679 - Hyper Micro SIDELED® LS Y876, LA Y876, LO Y876, LY Y876 LT Y87S - SmartLED LW L88C, LW L88S LB L89C, LB L89S, LG L890 LS L89K, LO L89K, LY L89K LS L896, LA L896, LO L896, LY L896 - TOPLED LS T670, LO T670, LY T670, LG T670, LP T670 LSG T670, LSP T670, LSY T670, LOP T670, LYG T670 LG T671, LOG T671, LSG T671 LB T673, LV T673, LT T673, LW T673 LH T674 LS T676, LA T676, LO T676, LY T676, LB T676, LH T676, LSB T676, LW T676 LB T67C, LV T67C, LT T67C, LS T67K, LO T67K, LY T67K, LW E67C LS E67B, LA E67B, LO E67B, LY E67B, LB E67C, LV E67C, LT E67C LW T67C LS T679, LY T679, LG T679 LS T770, LO T770, LY T770, LG T770, LP T770 LB T773, LV T773, LT T773, LW T773 LH T774 LS E675, LA E675, LY E675, LS T675 LS T776, LA T776, LO T776, LY T776, LB T776 LHGB T686 LT T68C, LB T68C - Hyper Mini TOPLED® LB M676 - Mini TOPLED Santana® LG M470 LS M47K, LO M47K, LY M47K Source: http://www.osram.convergy.de LUXEON: - LUMILED® LXK2-PW12-R00, LXK2-PW12-S00, LXK2-PW14-U00, LXK2-PW14-V00 LXK2-PM12-R00, LXK2-PM12-S00, LXK2-PM14-U00 LXK2-PE12-Q00, LXK2-PE12-R00, LXK2-PE12-S00, LXK2-PE14-T00, LXK2-PE14-U00 LXK2-PB12-K00, LXK2-PB12-L00, LXK2-PB12-M00, LXK2-PB14-N00, LXK2-PB14-P00, LXK2-PB14-Q00 LXK2-PR12-L00, LXK2-PR12-M00, LXK2-PR14-Q00, LXK2-PR14-R00 LXK2-PD12-Q00, LXK2-PD12-R00, LXK2-PD12-S00 LXK2-PH12-R00, LXK2-PH12-S00 LXK2-PL12-P00, LXK2-PL12-Q00, LXK2-PL12-R00 Source: www.luxeon.com KINGBRIGHT: KA-3528ASYC Source: www.kingbright.com
OK1-OK3 OK8 = optocoupler:PC817: SHARP OPTO COUPLER; MPN: PC817X4J000F; OC_FARNELL: 9707727; OC_NEWARK: 97K7059
OK4 = optocoupler:MOC30*: 6-Pin DIP Zero-Cross Optoisolators Triac Driver Output (250/400 Volt Peak) Source: Data sheet <http://www.fairchildsemi.com/ds/MO/MOC3031M.pdf> The old path of data sheet not more available 2013-05-06.; MF: FAIRCHILD SEMICONDUCTOR; MPN: MOC3041M; OC_FARNELL: 1086677; OC_NEWARK: 78K6090
OK5-OK7 = optocoupler:MOC30*: 6-Pin DIP Zero-Cross Optoisolators Triac Driver Output (250/400 Volt Peak) Source: Data sheet <http://www.fairchildsemi.com/ds/MO/MOC3031M.pdf> The old path of data sheet not more available 2013-05-06.; MF: FAIRCHILD SEMICONDUCTOR; MPN: MOC3031SM; OC_FARNELL: unknown; OC_NEWARK: 34C1335
Q1 Y1 = crystal:CRYSTAL: CRYSTAL; OC_FARNELL: unknown; OC_NEWARK: unknown
Q2 = SparkFun-DiscreteSemi:TRANSISTOR_NPN: Generic NPN BJT MMBT2222A - TRANS-08049 (SOT-23, 1A 40V) MPSA42 - TRANS-09116 (SOT-23, 500mA 300V) MMBT5088LT1G - TRANS-11160 (SOT-23, 50 mA 30V) BC547 - COM-08928 <http://www.sparkfun.com/products/8928> (TO-92 45V 100mA) (1.Collector 2.Base 3.Emitter) 2N3904 - COM-00521 <http://www.sparkfun.com/products/521> (TO-92 40V 200mA) (1.Emitter 2.Base 3.Collector) P2N2222A - COM-12852 <http://www.sparkfun.com/products/12852> (TO-92 40V 600mA) (1.Collector 2.Base 3.Emitter); PROD_ID: TRANS-08049
Q3-Q6 = SparkFun-DiscreteSemi:TRANSISTOR_NPN: Generic NPN BJT MMBT2222A - TRANS-08049 (SOT-23, 1A 40V) MPSA42 - TRANS-09116 (SOT-23, 500mA 300V) MMBT5088LT1G - TRANS-11160 (SOT-23, 50 mA 30V) BC547 - COM-08928 <http://www.sparkfun.com/products/8928> (TO-92 45V 100mA) (1.Collector 2.Base 3.Emitter) 2N3904 - COM-00521 <http://www.sparkfun.com/products/521> (TO-92 40V 200mA) (1.Emitter 2.Base 3.Collector) P2N2222A - COM-12852 <http://www.sparkfun.com/products/12852> (TO-92 40V 600mA) (1.Collector 2.Base 3.Emitter)
R1 R11 = varistor:S10K11: VARISTOR
R2 R4 R5 R9 R12 R15 R16 R21-R23 R27 R29 R31 R33 U$4-U$9 = SparkFun-Resistors:RESISTOR: Resistor Basic schematic elements and footprints for 0603, 1206, and PTH resistors.
R3 R6-R8 R14 = SparkFun-Passives:RESISTOR: Resistor Basic schematic elements and footprints for 0603, 1206, and PTH resistors.
R10 R17 R24-R26 R35 = rcl:R-EU_: RESISTOR, European symbol
R13 R28 R30 R32 R34 = rcl:R-US_: RESISTOR, American symbol
RN1 = resistor-sil:G07R: SIL RESISTOR; OC_FARNELL: unknown; OC_NEWARK: unknown
S1 = smd-special:SWS008: SMD Dip Switch 8 pol.
T1-T4 = triac:BT138: TRIAC Source: http://www.semiconductors.philips.com BT138_SERIES_2.pdf
U$1 = SparkFun-FreqCtrl:DS1307: I2C real-time clock with battery backup.
U$2 = SparkFun-RF:RF-LINK_RX: RF Link receivers- WRL-8947, 8948, 8949, 8950, 10532, 10533
U$3 = HM-11:HM-11
U$11 = SparkFun-Sensors:TEMPERATURE-SENSOR: TO-92 temp sensor
X1-X3 = con-molex:22-23-2051: .100" (2.54mm) Center Header - 5 Pin; MF: MOLEX; MPN: 22-23-2051; OC_FARNELL: 1462952; OC_NEWARK: 38C9178
X4 X9 X10 = con-ptr500:AK300/4: CONNECTOR; OC_FARNELL: unknown; OC_NEWARK: unknown
X5 = con-molex:22-23-2041: .100" (2.54mm) Center Header - 4 Pin; MF: MOLEX; MPN: 22-23-2041; OC_FARNELL: 1462920; OC_NEWARK: 38C0355
X7 = con-ptr500:AK300/3: CONNECTOR; OC_FARNELL: unknown; OC_NEWARK: unknown
X8 = con-ptr500:AK300/2: CONNECTOR; OC_FARNELL: unknown; OC_NEWARK: unknown